# EAGLE design Bachelorarbeit (EAGLE 6.2)
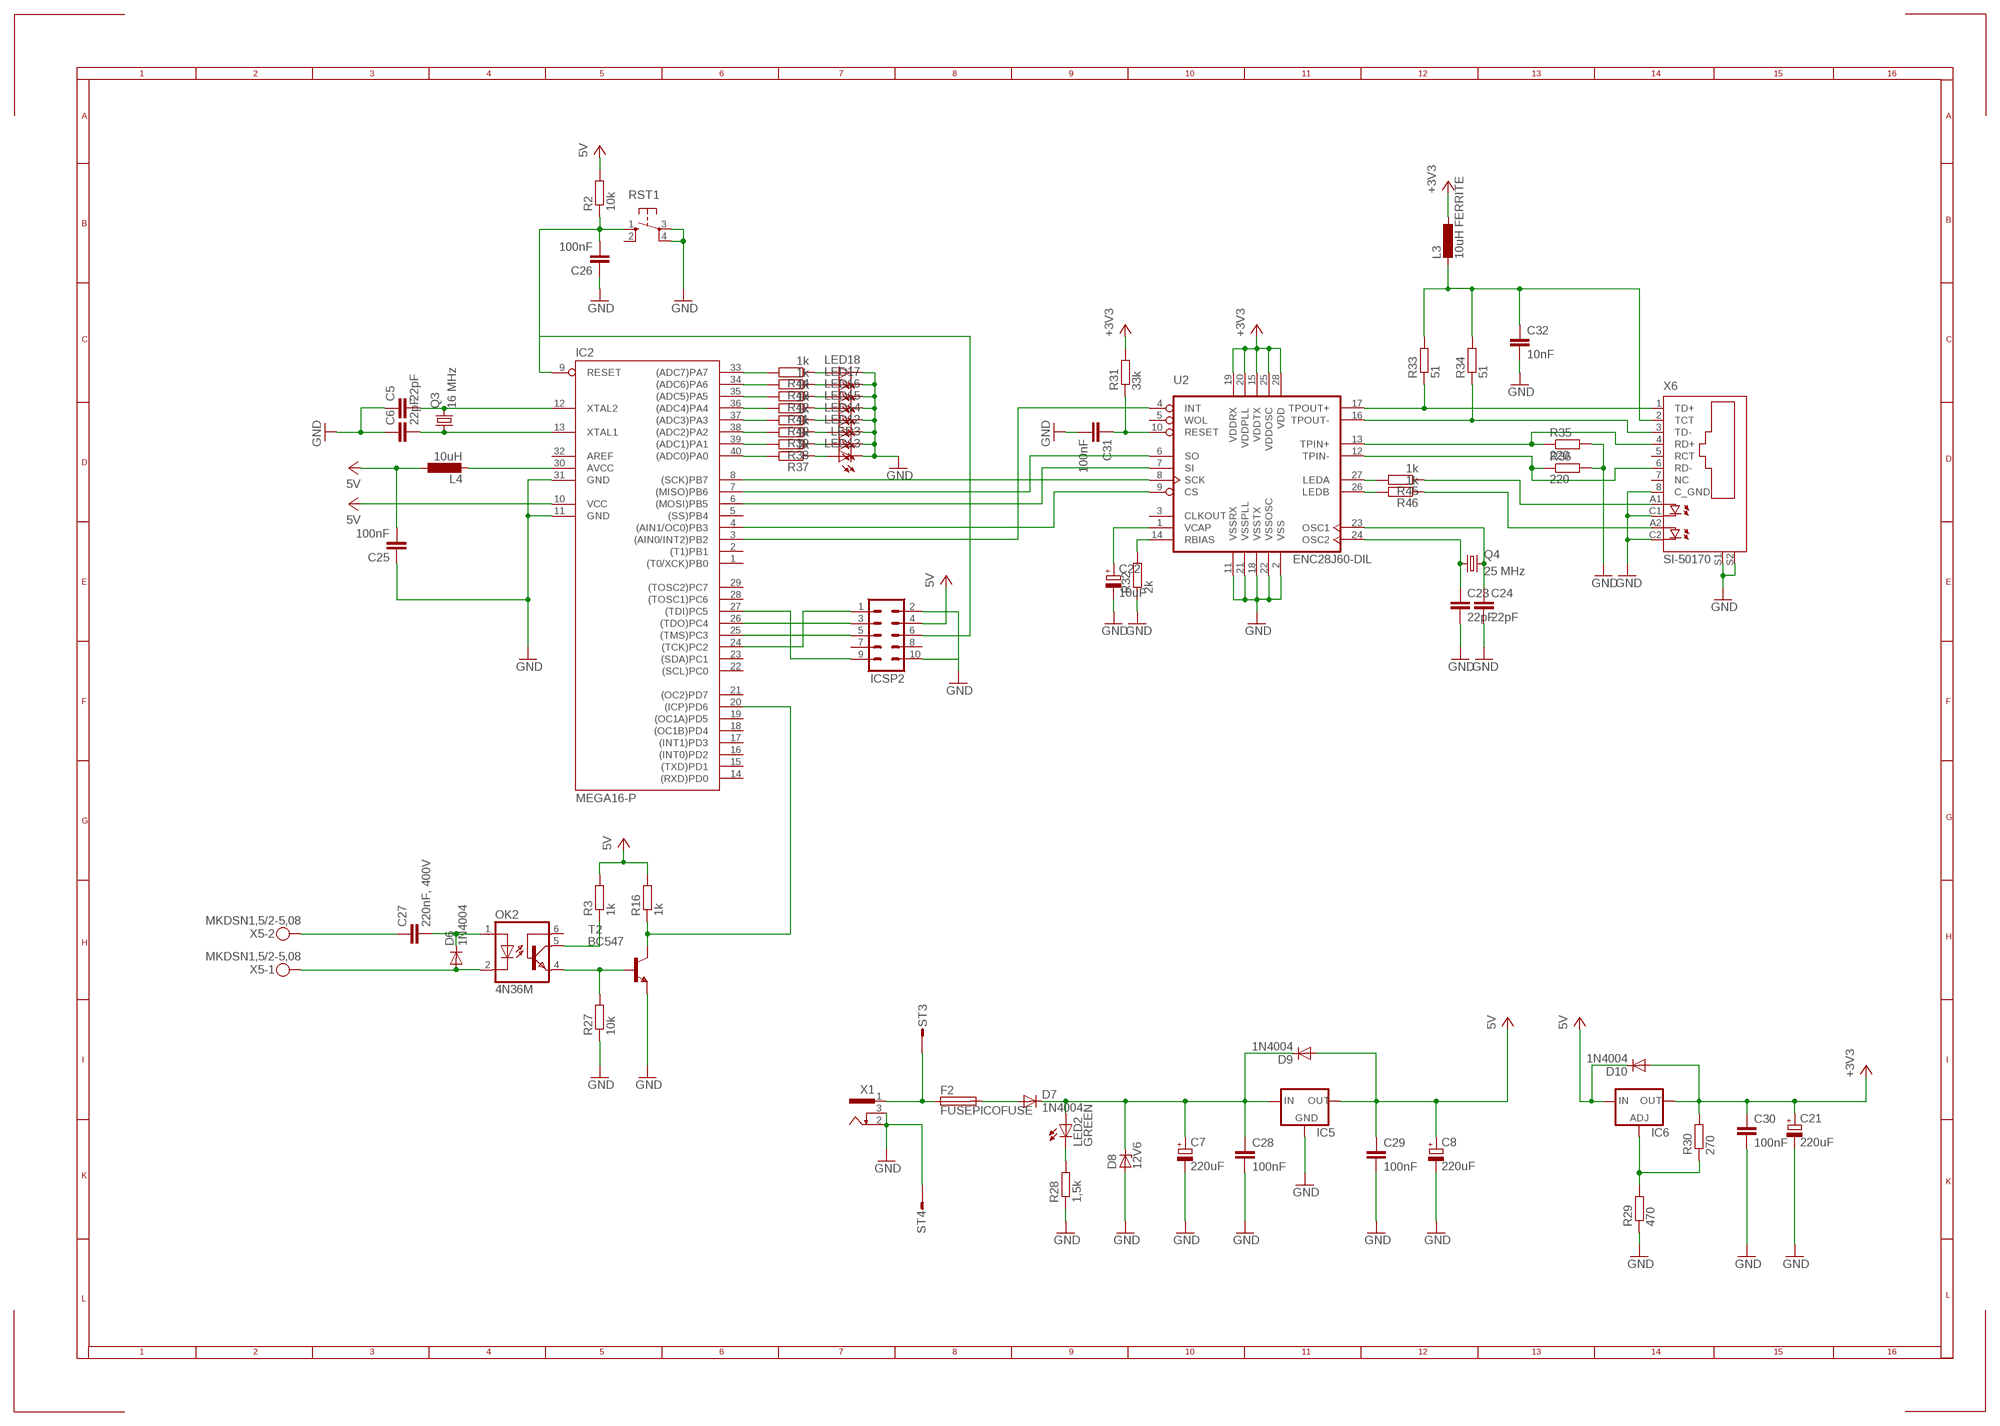
[diagram p0: schematic, sheet 1]

## Parts
C5  22pF  C-EU025-024X044  [C025-024X044]
C6  22pF  C-EU025-024X044  [C025-024X044]
C7  220uF  CPOL-EUE3.5-8  [E3,5-8]
C8  220uF  CPOL-EUE3.5-8  [E3,5-8]
C21  220uF  CPOL-EUE3.5-8  [E3,5-8]
C22  10uF  CPOL-EUE3.5-8  [E3,5-8]
C23  22pF  C-EU025-024X044  [C025-024X044]
C24  22pF  C-EU025-024X044  [C025-024X044]
C25  100nF  C-EU025-025X050  [C025-025X050]
C26  100nF  C-EU025-025X050  [C025-025X050]
C27  220nF, 400V  C-EU025-025X050  [C025-025X050]
C28  100nF  C-EU025-025X050  [C025-025X050]
C29  100nF  C-EU025-025X050  [C025-025X050]
C30  100nF  C-EU025-025X050  [C025-025X050]
C31  100nF  C-EU025-025X050  [C025-025X050]
C32  10nF  C-EU025-025X050  [C025-025X050]
D6  1N4004  [DO41-10]
D7  1N4004  [DO41-10]
D8  12V6  BZX90  [DO34Z7]
D9  1N4004  [DO41-10]
D10  1N4004  [DO41-10]
F2  FUSEPICOFUSE  [PICOFUSE]
IC2  MEGA16-P  [DIL40]
IC5  78XXS  [78XXS]
IC6  LM317TS  [317TS]
ICSP2  10V  [10V]
L3  10uH FERRITE  L-EU0204/5  [0204/5]
L4  10uH  L-EU0204/5  [0204/5]
LED2  GREEN  LED3MM  [LED3MM]
LED3  LED3MM  [LED3MM]
LED12  LED3MM  [LED3MM]
LED13  LED3MM  [LED3MM]
LED14  LED3MM  [LED3MM]
LED15  LED3MM  [LED3MM]
LED16  LED3MM  [LED3MM]
LED17  LED3MM  [LED3MM]
LED18  LED3MM  [LED3MM]
OK2  4N36M  [DIL06]
Q3  16 MHz  CRYSTALHC49U-V  [HC49U-V]
Q4  25 MHz  CRYSTALHC49U-V  [HC49U-V]
R2  10k  R-EU_0207/10  [0207/10]
R3  1k  R-EU_0207/10  [0207/10]
R16  1k  R-EU_0207/10  [0207/10]
R27  10k  R-EU_0207/10  [0207/10]
R28  1,5k  R-EU_0207/10  [0207/10]
R29  470  R-EU_0207/10  [0207/10]
R30  270  R-EU_0207/10  [0207/10]
R31  33k  R-EU_0207/10  [0207/10]
R32  2k  R-EU_0207/10  [0207/10]
R33  51  R-EU_0207/10  [0207/10]
R34  51  R-EU_0207/10  [0207/10]
R35  220  R-EU_0207/10  [0207/10]
R36  220  R-EU_0207/10  [0207/10]
R37  1k  R-EU_0207/10  [0207/10]
R38  1k  R-EU_0207/10  [0207/10]
R39  1k  R-EU_0207/10  [0207/10]
R40  1k  R-EU_0207/10  [0207/10]
R41  1k  R-EU_0207/10  [0207/10]
R42  1k  R-EU_0207/10  [0207/10]
R43  1k  R-EU_0207/10  [0207/10]
R44  1k  R-EU_0207/10  [0207/10]
R45  1k  R-EU_0207/10  [0207/10]
R46  1k  R-EU_0207/10  [0207/10]
RST1  10-XX  [B3F-10XX]
ST3  ST2,8  [ST2,8]
ST4  ST2,8  [ST2,8]
T2  BC547  [TO92]
U2  ENC28J60-DIL  [DIL28-3]
X1  SCD-014A  [SCD-014-A]
X5  MKDSN1,5/2-5,08  [MKDSN1,5/2-5,08]
X6  SI-50170  [SI-50170]

## Nets
GND [bakkarbeit]: C5.1 C6.1 C7.- C8.- C21.- C22.- C23.2 C24.2 C25.1 C26.1 C28.2 C29.2 C30.2 C31.2 C32.2 D8.A IC2.11(GND) IC2.31(GND) IC5.GND ICSP2.2 ICSP2.10 LED3.K(C) LED12.K(C) LED13.K(C) LED14.K(C) LED15.K(C) LED16.K(C) LED17.K(C) LED18.K(C) R27.1 R28.1 R29.1 R32.1 R35.2 R36.2 RST1.3(P) RST1.4(P1) ST4.1(ST) T2.1(E) U2.2(VSS) U2.11(VSSRX) U2.18(VSSTX) U2.21(VSSPLL) U2.22(VSSOSC) X1.2 X1.3 X6.8(C_GND) X6.C1(C) X6.C2(C1) X6.S1 X6.S2
N$37 [bakkarbeit]: C6.2 IC2.13(XTAL1) Q3.1
N$48 [bakkarbeit]: C5.2 IC2.12(XTAL2) Q3.2
N$49 [bakkarbeit]: C26.2 IC2.9(RESET) ICSP2.6 R2.1 RST1.1(S)
N$50 [bakkarbeit]: D6.A OK2.2(C) X5.1
N$51 [bakkarbeit]: C27.2 D6.C OK2.1(A)
N$52 [bakkarbeit]: OK2.4(EMI) R27.2 T2.2(B)
N$53 [bakkarbeit]: OK2.5(COL) R3.1
N$54 [bakkarbeit]: IC2.20((ICP)PD6) R16.1 T2.3(C)
N$55 [bakkarbeit]: F2.1 ST3.1(ST) X1.1
N$64 [bakkarbeit]: D7.A F2.2
N$65 [bakkarbeit]: C7.+ C28.1 D7.C D8.C D9.C IC5.IN LED2.A
N$66 [bakkarbeit]: LED2.K(C) R28.2
N$67 [bakkarbeit]: IC6.1(ADJ) R29.2 R30.1
N$68 [bakkarbeit]: IC2.3((AIN0/INT2)PB2) U2.4(INT)
N$69 [bakkarbeit]: C31.1 R31.1 U2.10(RESET)
N$70 [bakkarbeit]: IC2.7((MISO)PB6) U2.6(SO)
N$71 [bakkarbeit]: IC2.6((MOSI)PB5) U2.7(SI)
N$72 [bakkarbeit]: IC2.8((SCK)PB7) U2.8(SCK)
N$73 [bakkarbeit]: IC2.4((AIN1/OC0)PB3) U2.9(CS)
N$74 [bakkarbeit]: C22.+ U2.1(VCAP)
N$75 [bakkarbeit]: R32.2 U2.14(RBIAS)
N$76 [bakkarbeit]: IC2.30(AVCC) L4.2
N$77 [bakkarbeit]: LED18.A R44.1
N$78 [bakkarbeit]: LED17.A R43.1
N$79 [bakkarbeit]: LED16.A R42.1
N$80 [bakkarbeit]: LED15.A R41.1
N$81 [bakkarbeit]: LED14.A R40.1
N$82 [bakkarbeit]: LED12.A R39.1
N$83 [bakkarbeit]: LED3.A R38.1
N$84 [bakkarbeit]: LED13.A R37.1
N$85 [bakkarbeit]: C23.1 Q4.1 U2.24(OSC2)
N$86 [bakkarbeit]: C24.1 Q4.2 U2.23(OSC1)
N$87 [bakkarbeit]: C27.1 X5.2
N$88 [bakkarbeit]: R35.1 U2.13(TPIN+) X6.4(RD+)
N$89 [bakkarbeit]: R36.1 U2.12(TPIN-) X6.6(RD-)
N$90 [bakkarbeit]: R45.2 U2.27(LEDA)
N$91 [bakkarbeit]: R45.1 X6.A1(A)
N$92 [bakkarbeit]: R46.2 U2.26(LEDB)
N$93 [bakkarbeit]: R46.1 X6.A2(A1)
N$94 [bakkarbeit]: R34.1 U2.16(TPOUT-) X6.3(TD-)
N$95 [bakkarbeit]: R33.1 U2.17(TPOUT+) X6.1(TD+)
N$96 [bakkarbeit]: C32.1 L3.2 R33.2 R34.2 X6.2(TCT)
N$97: IC2.33((ADC7)PA7) R44.2
N$98: IC2.34((ADC6)PA6) R43.2
N$99: IC2.35((ADC5)PA5) R42.2
N$100: IC2.36((ADC4)PA4) R41.2
N$101: IC2.37((ADC3)PA3) R40.2
N$102: IC2.38((ADC2)PA2) R39.2
N$103: IC2.39((ADC1)PA1) R38.2
N$104: IC2.40((ADC0)PA0) R37.2
N$105: IC2.24((TCK)PC2) ICSP2.1
N$106: IC2.26((TDO)PC4) ICSP2.3
N$107: IC2.25((TMS)PC3) ICSP2.5
N$108: IC2.27((TDI)PC5) ICSP2.9
VCC [bakkarbeit]: C8.+ C21.+ C25.2 C29.1 C30.1 D9.A D10.A D10.C IC2.10(VCC) IC5.OUT IC6.2(OUT) IC6.3(IN) ICSP2.4 L3.1 L4.1 R2.2 R3.2 R16.2 R30.2 R31.2 U2.15(VDDTX) U2.19(VDDRX) U2.20(VDDPLL) U2.25(VDDOSC) U2.28(VDD) ; supply symbol labelled 5V, +3V3
Unconnected: IC2.1((T0/XCK)PB0) IC2.2((T1)PB1) IC2.5((SS)PB4) IC2.14((RXD)PD0) IC2.15((TXD)PD1) IC2.16((INT0)PD2) IC2.17((INT1)PD3) IC2.18((OC1B)PD4) IC2.19((OC1A)PD5) IC2.21((OC2)PD7) IC2.22((SCL)PC0) IC2.23((SDA)PC1) IC2.28((TOSC1)PC6) IC2.29((TOSC2)PC7) IC2.32(AREF) ICSP2.7 ICSP2.8 OK2.6(BAS) RST1.2(S1) U2.3(CLKOUT) U2.5(WOL) X6.5(RCT) X6.7(NC)

## Library data of the parts
C5 C6 C23-C32 = rcl:C-EU: CAPACITOR, European symbol
C7 C8 C21 C22 = rcl:CPOL-EU: POLARIZED CAPACITOR, European symbol
D6 D7 D9 D10 = diode:1N4004: DIODE general purpose rectifier, 1 A
D8 = diode:BZX90: Z DIODE
F2 = fuse:FUSE: Fuse; OC_FARNELL: unknown; OC_NEWARK: unknown
IC2 = atmel:MEGA16-P: MICROCONTROLLER 16 Kbytes FLASH 1 kbytes SRAM 512 bytes EEPROM USART 8-channel 10 bit ADC Source: avr.lbr; MPN: ATMEGA16-16PU; OC_FARNELL: 9171142; OC_NEWARK: 01M6885
IC5 = v-reg:78XXS: VOLTAGE REGULATOR
IC6 = v-reg:LM317TS: VOLTAGE REGULATOR
ICSP2 = con-harting-v:10V: CONNECTOR; OC_FARNELL: unknown; OC_NEWARK: unknown
L3 L4 = rcl:L-EU: INDUCTOR, European symbol
LED2 LED3 LED12-LED18 = led:LED: LED OSRAM: - CHIPLED LG R971, LG N971, LY N971, LG Q971, LY Q971, LO R971, LY R971 LH N974, LH R974 LS Q976, LO Q976, LY Q976 LO Q996 - Hyper CHIPLED LW Q18S LB Q993, LB Q99A, LB R99A - SideLED LS A670, LO A670, LY A670, LG A670, LP A670 LB A673, LV A673, LT A673, LW A673 LH A674 LY A675 LS A676, LA A676, LO A676, LY A676, LW A676 LS A679, LY A679, LG A679 - Hyper Micro SIDELED® LS Y876, LA Y876, LO Y876, LY Y876 LT Y87S - SmartLED LW L88C, LW L88S LB L89C, LB L89S, LG L890 LS L89K, LO L89K, LY L89K LS L896, LA L896, LO L896, LY L896 - TOPLED LS T670, LO T670, LY T670, LG T670, LP T670 LSG T670, LSP T670, LSY T670, LOP T670, LYG T670 LG T671, LOG T671, LSG T671 LB T673, LV T673, LT T673, LW T673 LH T674 LS T676, LA T676, LO T676, LY T676, LB T676, LH T676, LSB T676, LW T676 LB T67C, LV T67C, LT T67C, LS T67K, LO T67K, LY T67K, LW E67C LS E67B, LA E67B, LO E67B, LY E67B, LB E67C, LV E67C, LT E67C LW T67C LS T679, LY T679, LG T679 LS T770, LO T770, LY T770, LG T770, LP T770 LB T773, LV T773, LT T773, LW T773 LH T774 LS E675, LA E675, LY E675, LS T675 LS T776, LA T776, LO T776, LY T776, LB T776 LHGB T686 LT T68C, LB T68C - Hyper Mini TOPLED® LB M676 - Mini TOPLED Santana® LG M470 LS M47K, LO M47K, LY M47K Source: http://www.osram.convergy.de LUXEON: - LUMILED® LXK2-PW12-R00, LXK2-PW12-S00, LXK2-PW14-U00, LXK2-PW14-V00 LXK2-PM12-R00, LXK2-PM12-S00, LXK2-PM14-U00 LXK2-PE12-Q00, LXK2-PE12-R00, LXK2-PE12-S00, LXK2-PE14-T00, LXK2-PE14-U00 LXK2-PB12-K00, LXK2-PB12-L00, LXK2-PB12-M00, LXK2-PB14-N00, LXK2-PB14-P00, LXK2-PB14-Q00 LXK2-PR12-L00, LXK2-PR12-M00, LXK2-PR14-Q00, LXK2-PR14-R00 LXK2-PD12-Q00, LXK2-PD12-R00, LXK2-PD12-S00 LXK2-PH12-R00, LXK2-PH12-S00 LXK2-PL12-P00, LXK2-PL12-Q00, LXK2-PL12-R00 Source: www.luxeon.com KINGBRIGHT: KA-3528ASYC Source: www.kingbright.com
OK2 = optocoupler:4N*?M: General Purpose 6-Pin Phototransistor Optocouplers Source: http://www.fairchildsemi.com/ds/4N/4N35-M.pdf; MPN: 4N36-M; OC_FARNELL: 1021352; OC_NEWARK: 98K9120
Q3 Q4 = crystal:CRYSTAL: CRYSTAL; OC_FARNELL: 1666969; OC_NEWARK: unknown
R2 R3 R16 R27-R46 = rcl:R-EU_: RESISTOR, European symbol
RST1 = switch-omron:10-XX: OMRON SWITCH; MPN: B3F-1000; OC_FARNELL: 176432; OC_NEWARK: 36M3542
ST3 ST4 = con-rib:ST2,8: RIBBON CABLE CONNECTOR Flachstecker / Faston; OC_FARNELL: unknown; OC_NEWARK: unknown
T2 = transistor:BC547: NPN TRANSISTOR
U2 = enc28j60:ENC28J60-*: Microchip 10Mbit Ethernet controller with SPI interface Improved SOIC28 layout (pads in 0.01 raster, pin1 slightly smaller). Pin 6 (SO) changed from Out (paralleling several Outs gives an error) to OC. Author: Profi from mikrocontroller.net - forum Date: 2006.0827
X1 = con-shiua-chyuan:SCD-014A: Power Jack 2.5mm; OC_FARNELL: unknown; OC_NEWARK: unknown
X5 = con-phoenix-508:MKDSN1,5/2-5,08: MKDSN 1,5/ 2-5,08 Printklemme Nennstrom: 13,5 A Nennspannung: 250 V Rastermaß: 5,08 mm Polzahl: 2 Anschlussart: Schraubanschluss Montage: Löten Anschlussrichtung Leiter/Platine: 0 ° Artikelnummer: 1729128 Source: http://eshop.phoenixcontact.com .. 1729128.pdf; MPN: MKDSN 1,5/2-5.08; OC_FARNELL: 1792903; OC_NEWARK: 30M2397
X6 = con-stewart:SI-50170: Ethernet Connector MagJack (R) Source: www.stewartconnector.com .. si-50170.pdf; OC_FARNELL: unknown; OC_NEWARK: unknown

## Net classes
1 bakkarbeit: width 0.406 mm, drill 0.406 mm, clearance 0.406 mm

## Board
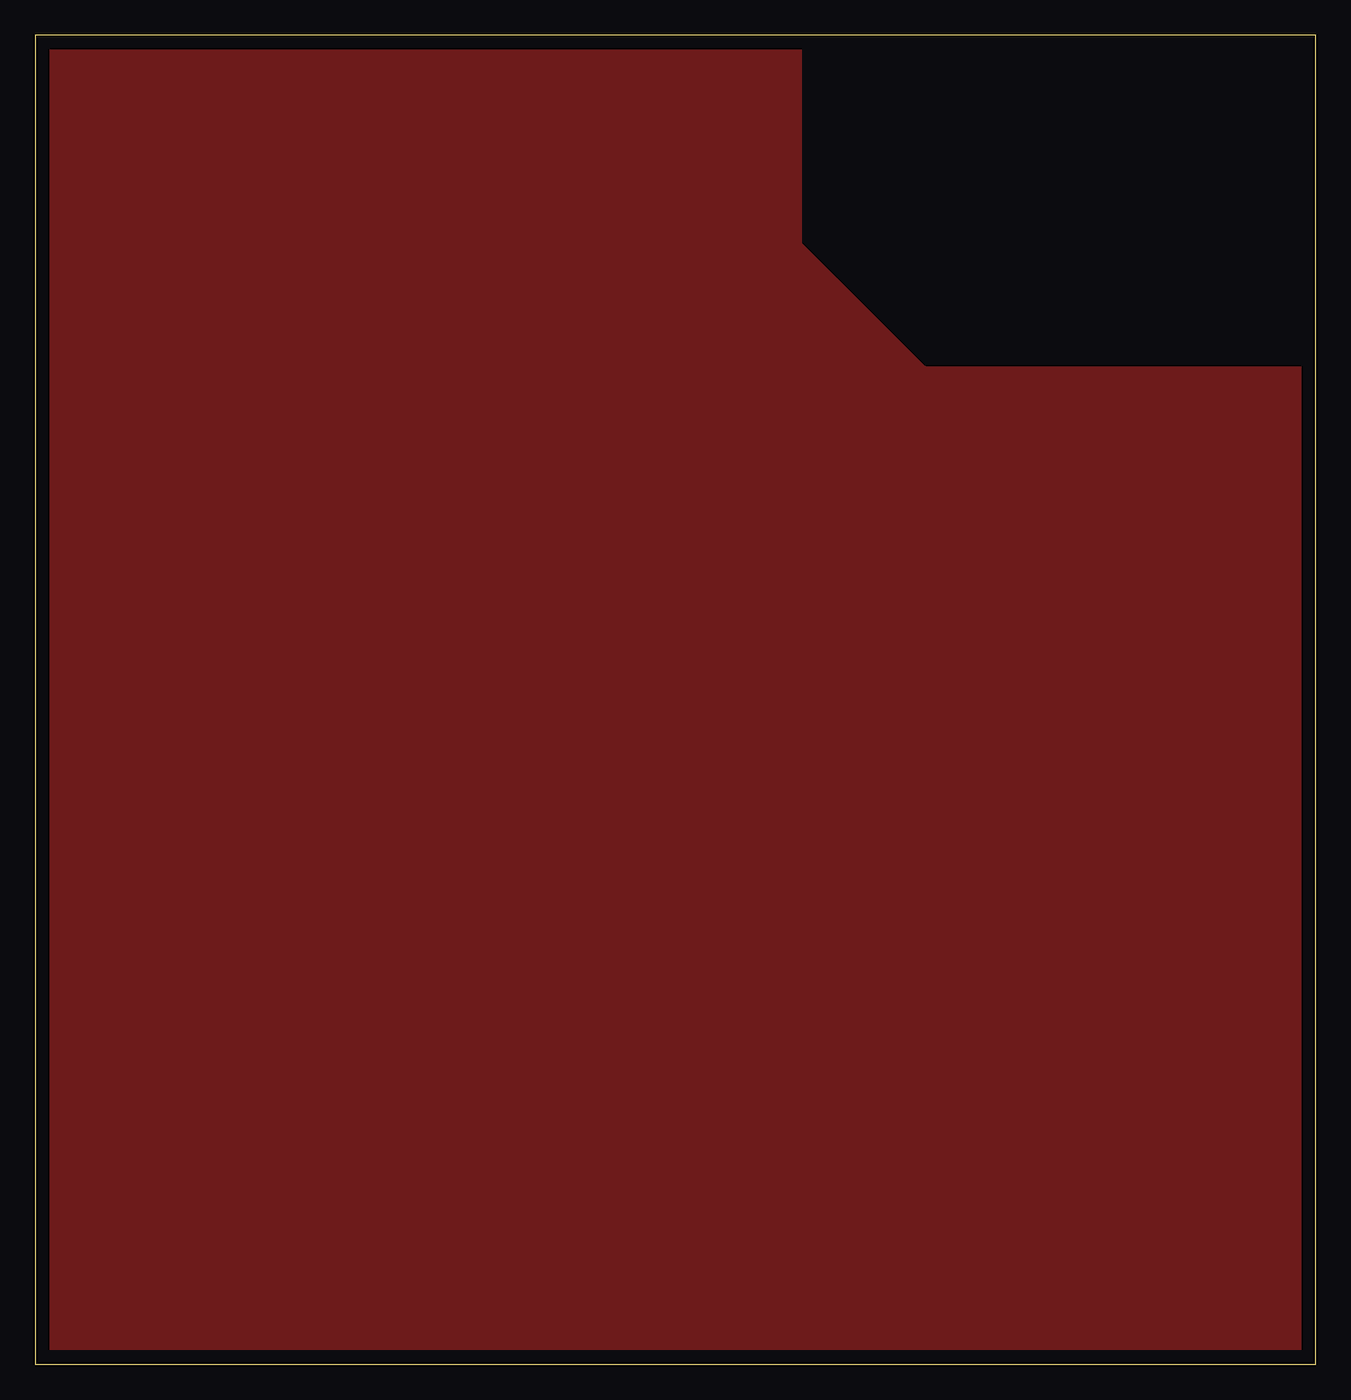
[diagram p1: board, top side]

Size 91.42 x 94.92 mm. Coordinates in mm from the lower left corner, seen from the top.
Outline: 0,0 91.42,0 91.42,94.92 0,94.92 0,0
Copper layers (1*16): Top 0.035mm / dielectric 1.5mm / Bottom 0.035mm
Design rules: minimum track width 10mil, minimum drill 24mil, track to track 8mil, track to pad 8mil, pad to pad 8mil, via to via 8mil, smd to smd 8mil, copper to edge 40mil, drill to drill 8mil, minimum pad ring 10mil, minimum via ring 8mil, stop-mask expansion 4mil, vias tented up to drill 0mil, thermal gap 10mil

### Footprints (pad centres in the part's own frame; a part is rotated, then mirrored left to right if it is on the bottom)
C025-024X044 = drill 0.813 octagon: 1 -1.27,0; 2 1.27,0
E3,5-8 = drill 0.813 pad 1.6: + -1.778,0 | drill 0.813 pad 1.6 octagon: - 1.778,0
C025-025X050 = drill 0.813 octagon: 1 -1.27,0; 2 1.27,0
DO41-10 = drill 1.118: A 5.08,0; C -5.08,0
DO34Z7 = drill 0.813 long: A 3.81,0; C -3.81,0
PICOFUSE = drill 0.813 long: 1 -5.08,0; 2 5.08,0
DIL40 = drill 0.813 long: 1 -24.13,-7.62; 2 -21.59,-7.62; 3 -19.05,-7.62; 4 -16.51,-7.62; 5 -13.97,-7.62; 6 -11.43,-7.62; 7 -8.89,-7.62; 8 -6.35,-7.62; 9 -3.81,-7.62; 10 -1.27,-7.62; 11 1.27,-7.62; 12 3.81,-7.62; 13 6.35,-7.62; 14 8.89,-7.62; 15 11.43,-7.62; 16 13.97,-7.62; 17 16.51,-7.62; 18 19.05,-7.62; 19 21.59,-7.62; 20 24.13,-7.62; 21 24.13,7.62; 22 21.59,7.62; 23 19.05,7.62; 24 16.51,7.62; 25 13.97,7.62; 26 11.43,7.62; 27 8.89,7.62; 28 6.35,7.62; 29 3.81,7.62; 30 1.27,7.62; 31 -1.27,7.62; 32 -3.81,7.62; 33 -6.35,7.62; 34 -8.89,7.62; 35 -11.43,7.62; 36 -13.97,7.62; 37 -16.51,7.62; 38 -19.05,7.62; 39 -21.59,7.62; 40 -24.13,7.62
78XXS = drill 1.016 long: GND 0,-2.54; IN -2.54,-2.54; OUT 2.54,-2.54
317TS = drill 1.016 long: 1 -2.54,-2.54; 2 0,-2.54; 3 2.54,-2.54
10V = drill 0.914: 1 -5.08,-1.27 | drill 0.914 octagon: 2 -5.08,1.27; 3 -2.54,-1.27; 4 -2.54,1.27; 5 0,-1.27; 6 0,1.27; 7 2.54,-1.27; 8 2.54,1.27; 9 5.08,-1.27; 10 5.08,1.27 | hole 3.302: 13.97,-0.254; -13.97,-0.254
0204/5 = drill 0.813 octagon: 1 -2.54,0; 2 2.54,0
LED3MM = drill 0.813 octagon: A -1.27,0; K 1.27,0
DIL06 = drill 0.813 offset: 1 -2.54,-3.81; 2 0,-3.81; 3 2.54,-3.81; 4 2.54,3.81; 5 0,3.81; 6 -2.54,3.81
HC49U-V = drill 0.813: 1 -2.413,0; 2 2.413,0
0207/10 = drill 0.813 octagon: 1 -5.08,0; 2 5.08,0
B3F-10XX = drill 1.016 long: 1 -3.251,2.261; 2 3.251,2.261; 3 -3.251,-2.261; 4 3.251,-2.261
ST2,8 = drill 1.321 long: 1 0,0
TO92 = drill 0.813 octagon: 1 1.27,0; 2 0,1.905; 3 -1.27,0
DIL28-3 = drill 0.813 long: 1 -16.51,-3.81; 2 -13.97,-3.81; 3 -11.43,-3.81; 4 -8.89,-3.81; 5 -6.35,-3.81; 6 -3.81,-3.81; 7 -1.27,-3.81; 8 1.27,-3.81; 9 3.81,-3.81; 10 6.35,-3.81; 11 8.89,-3.81; 12 11.43,-3.81; 13 13.97,-3.81; 14 16.51,-3.81; 15 16.51,3.81; 16 13.97,3.81; 17 11.43,3.81; 18 8.89,3.81; 19 6.35,3.81; 20 3.81,3.81; 21 1.27,3.81; 22 -1.27,3.81; 23 -3.81,3.81; 24 -6.35,3.81; 25 -8.89,3.81; 26 -11.43,3.81; 27 -13.97,3.81; 28 -16.51,3.81
SCD-014-A = drill 1 pad 2 long: 1 -2.5,13.8; 2 -2.5,7.5; 3 2.5,10.8
MKDSN1,5/2-5,08 = drill 1.3 pad 2: 1 -2.561,0.025; 2 2.519,0.025
SI-50170 = drill 0.9 pad 1.5: 1 4.445,5.842; 2 3.175,3.302; 3 1.905,5.842; 4 0.635,3.302; 5 -0.635,5.842; 6 -1.905,3.302; 7 -3.175,5.842; 8 -4.445,3.302 | drill 1.016 pad 1.5: A1 -5.461,10.668; A2 2.921,10.668; C1 -2.921,10.668; C2 5.461,10.668 | drill 1.6 pad 2.2: S1 -7.747,0; S2 7.747,0 | hole 3.251: -5.715,-3.048; 5.715,-3.048

### Placement (x,y rotation side)
C5  21.59,-80.01 0 top  (outside the outline)
C6  27.94,-80.01 0 top  (outside the outline)
C7  15.24,-64.77 0 top  (outside the outline)
C8  26.67,-64.77 0 top  (outside the outline)
C21  -7.62,-64.77 0 top  (outside the outline)
C22  3.81,-64.77 0 top  (outside the outline)
C23  34.29,-80.01 0 top  (outside the outline)
C24  40.64,-80.01 0 top  (outside the outline)
C25  58.42,-72.39 0 top  (outside the outline)
C26  64.77,-72.39 0 top  (outside the outline)
C27  46.99,-72.39 0 top  (outside the outline)
C28  -8.89,-80.01 0 top  (outside the outline)
C29  -2.54,-80.01 0 top  (outside the outline)
C30  3.81,-80.01 0 top  (outside the outline)
C31  10.16,-80.01 0 top  (outside the outline)
C32  16.51,-80.01 0 top  (outside the outline)
D6  63.5,-63.5 0 top  (outside the outline)
D7  -6.35,-72.39 0 top  (outside the outline)
D8  60.96,-78.74 0 top  (outside the outline)
D9  6.35,-72.39 0 top  (outside the outline)
D10  19.05,-72.39 0 top  (outside the outline)
F2  31.75,-72.39 0 top  (outside the outline)
IC2  35.56,-13.97 0 top  (outside the outline)
IC5  39.37,-60.96 0 top  (outside the outline)
IC6  50.8,-60.96 0 top  (outside the outline)
ICSP2  40.64,-38.1 0 top  (outside the outline)
L3  -8.89,-86.36 0 top  (outside the outline)
L4  3.81,-86.36 0 top  (outside the outline)
LED2  2.54,-106.68 0 top  (outside the outline)
LED3  12.7,-111.76 0 top  (outside the outline)
LED12  13.97,-106.68 0 top  (outside the outline)
LED13  25.4,-106.68 0 top  (outside the outline)
LED14  36.83,-106.68 0 top  (outside the outline)
LED15  48.26,-106.68 0 top  (outside the outline)
LED16  59.69,-106.68 0 top  (outside the outline)
LED17  -10.16,-111.76 0 top  (outside the outline)
LED18  1.27,-111.76 0 top  (outside the outline)
OK2  19.05,-38.1 0 top  (outside the outline)
Q3  33.02,-52.07 0 top  (outside the outline)
Q4  44.45,-52.07 0 top  (outside the outline)
R2  26.67,-87.63 0 top  (outside the outline)
R3  39.37,-87.63 0 top  (outside the outline)
R16  52.07,-87.63 0 top  (outside the outline)
R27  64.77,-87.63 0 top  (outside the outline)
R28  -6.35,-92.71 0 top  (outside the outline)
R29  6.35,-92.71 0 top  (outside the outline)
R30  19.05,-92.71 0 top  (outside the outline)
R31  31.75,-92.71 0 top  (outside the outline)
R32  44.45,-92.71 0 top  (outside the outline)
R33  57.15,-92.71 0 top  (outside the outline)
R34  -6.35,-97.79 0 top  (outside the outline)
R35  6.35,-97.79 0 top  (outside the outline)
R36  19.05,-97.79 0 top  (outside the outline)
R37  31.75,-97.79 0 top  (outside the outline)
R38  44.45,-97.79 0 top  (outside the outline)
R39  57.15,-97.79 0 top  (outside the outline)
R40  -6.35,-102.87 0 top  (outside the outline)
R41  6.35,-102.87 0 top  (outside the outline)
R42  19.05,-102.87 0 top  (outside the outline)
R43  31.75,-102.87 0 top  (outside the outline)
R44  44.45,-102.87 0 top  (outside the outline)
R45  57.15,-102.87 0 top  (outside the outline)
R46  -6.35,-107.95 0 top  (outside the outline)
RST1  55.88,-53.34 0 top  (outside the outline)
ST3  46.99,-80.01 0 top  (outside the outline)
ST4  52.07,-80.01 0 top  (outside the outline)
T2  10.16,-86.36 0 top  (outside the outline)
U2  8.89,-53.34 0 top  (outside the outline)
X1  -5.08,-45.72 0 top  (outside the outline)
X5  5.08,-41.91 0 top  (outside the outline)
X6  -2.54,-16.51 0 top  (outside the outline)

### Tracks (layer width: path | path; a pad name or v marks a point on that pad's centre or on a via)
GND  (50 unrouted)
N$37  (2 unrouted)
  pour Top (isolate 0.305): 0,95.25 54.61,95.25 54.61,80.01 63.31,71.31 arc45 63.76,71.12 91.44,71.12 91.44,0 0,0
N$48  (2 unrouted)
N$49  (4 unrouted)
N$50  (2 unrouted)
N$51  (2 unrouted)
N$52  (2 unrouted)
N$53  (1 unrouted)
N$54  (2 unrouted)
N$55  (2 unrouted)
N$64  (1 unrouted)
N$65  (6 unrouted)
N$66  (1 unrouted)
N$67  (2 unrouted)
N$68  (1 unrouted)
N$69  (2 unrouted)
N$70  (1 unrouted)
N$71  (1 unrouted)
N$72  (1 unrouted)
N$73  (1 unrouted)
N$74  (1 unrouted)
N$75  (1 unrouted)
N$76  (1 unrouted)
N$77  (1 unrouted)
N$78  (1 unrouted)
N$79  (1 unrouted)
N$80  (1 unrouted)
N$81  (1 unrouted)
N$82  (1 unrouted)
N$83  (1 unrouted)
N$84  (1 unrouted)
N$85  (2 unrouted)
N$86  (2 unrouted)
N$87  (1 unrouted)
N$88  (2 unrouted)
N$89  (2 unrouted)
N$90  (1 unrouted)
N$91  (1 unrouted)
N$92  (1 unrouted)
N$93  (1 unrouted)
N$94  (2 unrouted)
N$95  (2 unrouted)
N$96  (4 unrouted)
N$97  (1 unrouted)
N$98  (1 unrouted)
N$99  (1 unrouted)
N$100  (1 unrouted)
N$101  (1 unrouted)
N$102  (1 unrouted)
N$103  (1 unrouted)
N$104  (1 unrouted)
N$105  (1 unrouted)
N$106  (1 unrouted)
N$107  (1 unrouted)
N$108  (1 unrouted)
VCC  (24 unrouted)